# Altium schematic sheet Servo3.SchDoc
size 420 x 297 mm; SheetNumber: 21; SheetTotal: 32
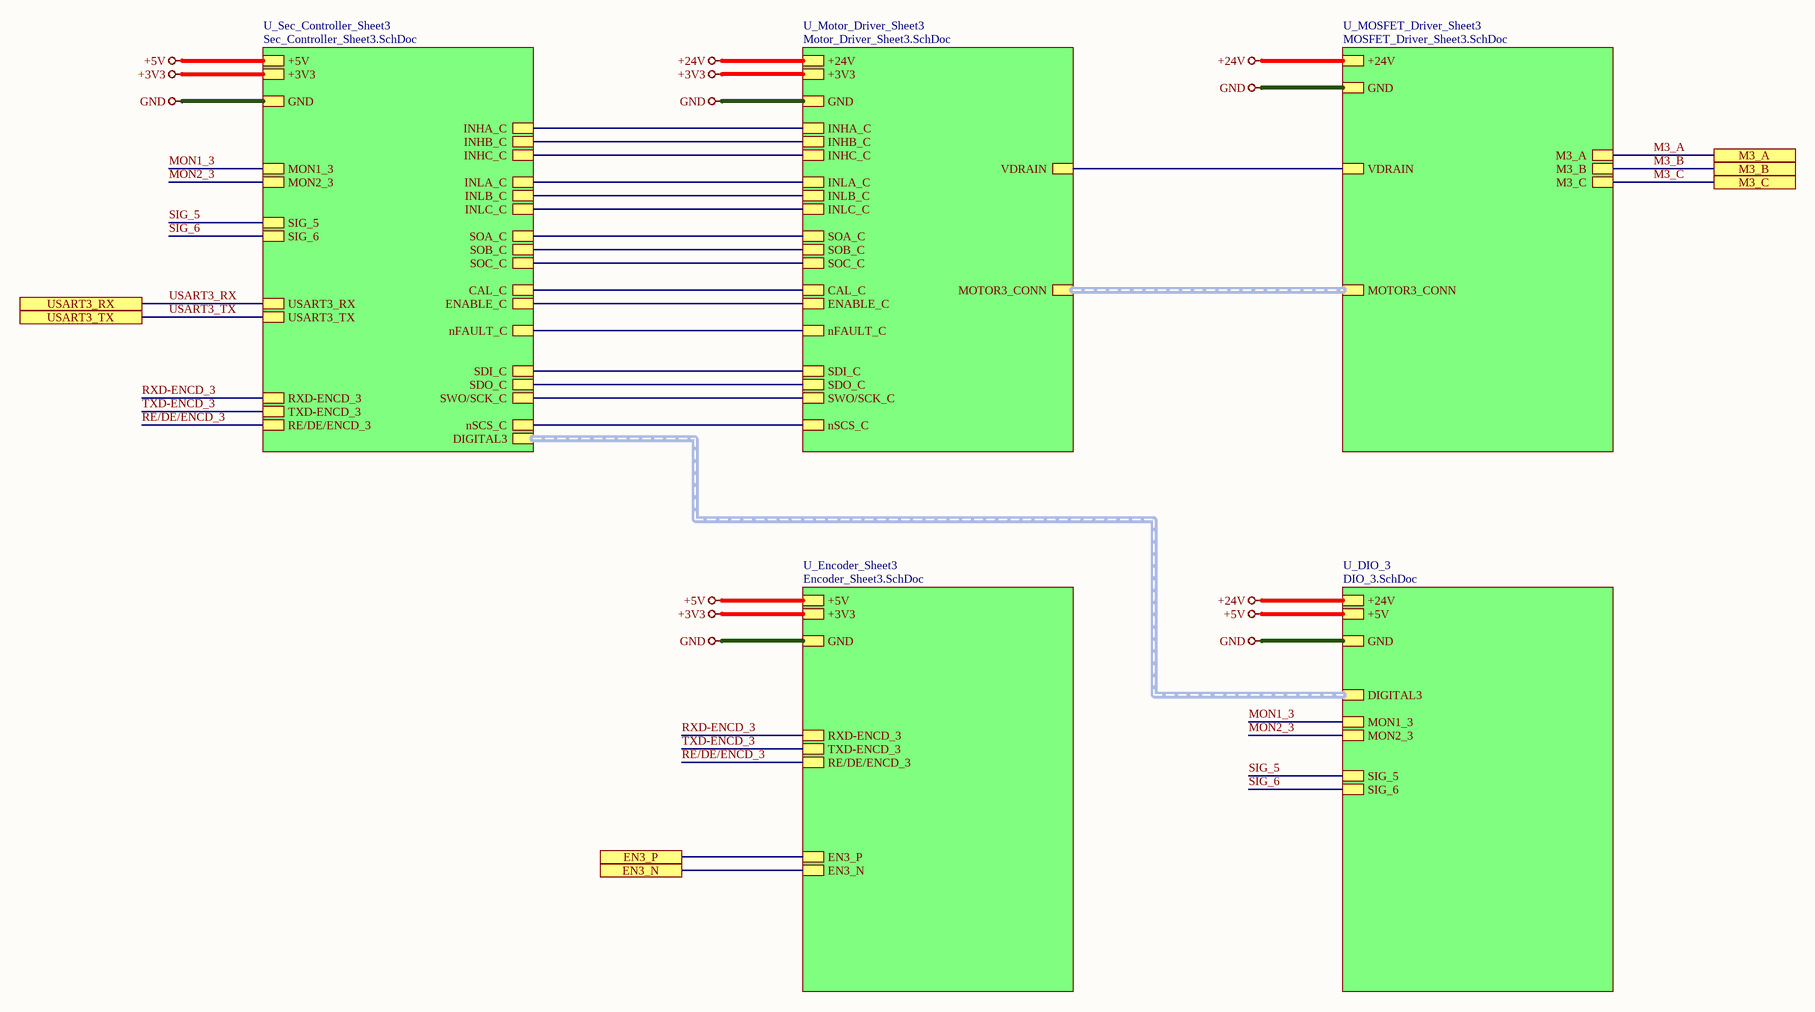
[diagram p0: Servo3.SchDoc]

## Sub-sheets
U_DIO_3 = DIO_3.SchDoc: +24V, +5V, GND, MON1_3, MON2_3, SIG_5, SIG_6, DIGITAL3 (harness DIGITAL1)
U_Encoder_Sheet3 = Encoder_Sheet3.SchDoc: +3V3, +5V, GND, EN3_N, EN3_P, RXD-ENCD_3, TXD-ENCD_3, RE/DE/ENCD_3
U_MOSFET_Driver_Sheet3 = MOSFET_Driver_Sheet3.SchDoc: +24V, GND, MOTOR3_CONN (harness MOTOR3_CONN), M3_A, M3_B, M3_C, VDRAIN
U_Motor_Driver_Sheet3 = Motor_Driver_Sheet3.SchDoc: +24V, +3V3, GND, MOTOR3_CONN (harness MOTOR3_CONN), INHA_C, INHB_C, INHC_C, INLA_C, INLB_C, INLC_C, nSCS_C, SDI_C, SDO_C, SWO/SCK_C, SOC_C, SOB_C, SOA_C, CAL_C, ENABLE_C, VDRAIN, nFAULT_C
U_Sec_Controller_Sheet3 = Sec_Controller_Sheet3.SchDoc: +3V3, GND, INHA_C, INHB_C, INHC_C, INLA_C, INLB_C, INLC_C, nSCS_C, SDI_C, SDO_C, SWO/SCK_C, SOC_C, SOB_C, SOA_C, CAL_C, ENABLE_C, nFAULT_C, USART3_RX, USART3_TX, RXD-ENCD_3, TXD-ENCD_3, RE/DE/ENCD_3, MON1_3, MON2_3, SIG_5, SIG_6, DIGITAL3 (harness DIGITAL1), +5V

## Ports
EN3_N (see Top_Sheet[4B], Connector_Sheet[3D], Encoder_Sheet3[2D]), EN3_P (see Top_Sheet[4B], Connector_Sheet[3D], Encoder_Sheet3[2D]), M3_A (see Top_Sheet[4C], Connector_Sheet[4D], MOSFET_Driver_Sheet3[3D]), M3_B (see Top_Sheet[4C], Connector_Sheet[4D], MOSFET_Driver_Sheet3[3D]), M3_C (see Top_Sheet[4C], Connector_Sheet[4D], MOSFET_Driver_Sheet3[3D]), USART3_RX (see Top_Sheet[4B], Controller_Sheet[2D], Sec_Controller_Sheet3[1D]), USART3_TX (see Top_Sheet[4B], Controller_Sheet[2D], Sec_Controller_Sheet3[1D])

## Nets
+3V3: sheet U_Motor_Driver_Sheet3/+3V3, sheet U_Sec_Controller_Sheet3/+3V3, sheet U_Encoder_Sheet3/+3V3
+5V: sheet U_Sec_Controller_Sheet3/+5V, sheet U_Encoder_Sheet3/+5V, sheet U_DIO_3/+5V
+24V: sheet U_MOSFET_Driver_Sheet3/+24V, sheet U_Motor_Driver_Sheet3/+24V, sheet U_DIO_3/+24V
GND: sheet U_MOSFET_Driver_Sheet3/GND, sheet U_Motor_Driver_Sheet3/GND, sheet U_Sec_Controller_Sheet3/GND, sheet U_Encoder_Sheet3/GND, sheet U_DIO_3/GND
EN3_N: port EN3_N, sheet U_Encoder_Sheet3/EN3_N
EN3_P: port EN3_P, sheet U_Encoder_Sheet3/EN3_P
M3_A: port M3_A, sheet U_MOSFET_Driver_Sheet3/M3_A
M3_B: port M3_B, sheet U_MOSFET_Driver_Sheet3/M3_B
M3_C: port M3_C, sheet U_MOSFET_Driver_Sheet3/M3_C
MON1_3: sheet U_Sec_Controller_Sheet3/MON1_3, sheet U_DIO_3/MON1_3
MON2_3: sheet U_Sec_Controller_Sheet3/MON2_3, sheet U_DIO_3/MON2_3
RE/DE/ENCD_3: sheet U_Sec_Controller_Sheet3/RE/DE/ENCD_3, sheet U_Encoder_Sheet3/RE/DE/ENCD_3
RXD-ENCD_3: sheet U_Sec_Controller_Sheet3/RXD-ENCD_3, sheet U_Encoder_Sheet3/RXD-ENCD_3
SIG_5: sheet U_Sec_Controller_Sheet3/SIG_5, sheet U_DIO_3/SIG_5
SIG_6: sheet U_Sec_Controller_Sheet3/SIG_6, sheet U_DIO_3/SIG_6
TXD-ENCD_3: sheet U_Sec_Controller_Sheet3/TXD-ENCD_3, sheet U_Encoder_Sheet3/TXD-ENCD_3
USART3_RX: port USART3_RX, sheet U_Sec_Controller_Sheet3/USART3_RX
USART3_TX: port USART3_TX, sheet U_Sec_Controller_Sheet3/USART3_TX
(unnamed): sheet U_MOSFET_Driver_Sheet3/VDRAIN, sheet U_Motor_Driver_Sheet3/VDRAIN
(unnamed): sheet U_Motor_Driver_Sheet3/INHA_C, sheet U_Sec_Controller_Sheet3/INHA_C
(unnamed): sheet U_Motor_Driver_Sheet3/INHB_C, sheet U_Sec_Controller_Sheet3/INHB_C
(unnamed): sheet U_Motor_Driver_Sheet3/INHC_C, sheet U_Sec_Controller_Sheet3/INHC_C
(unnamed): sheet U_Motor_Driver_Sheet3/INLA_C, sheet U_Sec_Controller_Sheet3/INLA_C
(unnamed): sheet U_Motor_Driver_Sheet3/INLB_C, sheet U_Sec_Controller_Sheet3/INLB_C
(unnamed): sheet U_Motor_Driver_Sheet3/INLC_C, sheet U_Sec_Controller_Sheet3/INLC_C
(unnamed): sheet U_Motor_Driver_Sheet3/nSCS_C, sheet U_Sec_Controller_Sheet3/nSCS_C
(unnamed): sheet U_Motor_Driver_Sheet3/SDI_C, sheet U_Sec_Controller_Sheet3/SDI_C
(unnamed): sheet U_Motor_Driver_Sheet3/SDO_C, sheet U_Sec_Controller_Sheet3/SDO_C
(unnamed): sheet U_Motor_Driver_Sheet3/SWO/SCK_C, sheet U_Sec_Controller_Sheet3/SWO/SCK_C
(unnamed): sheet U_Motor_Driver_Sheet3/SOC_C, sheet U_Sec_Controller_Sheet3/SOC_C
(unnamed): sheet U_Motor_Driver_Sheet3/SOB_C, sheet U_Sec_Controller_Sheet3/SOB_C
(unnamed): sheet U_Motor_Driver_Sheet3/SOA_C, sheet U_Sec_Controller_Sheet3/SOA_C
(unnamed): sheet U_Motor_Driver_Sheet3/CAL_C, sheet U_Sec_Controller_Sheet3/CAL_C
(unnamed): sheet U_Motor_Driver_Sheet3/ENABLE_C, sheet U_Sec_Controller_Sheet3/ENABLE_C
(unnamed): sheet U_Motor_Driver_Sheet3/nFAULT_C, sheet U_Sec_Controller_Sheet3/nFAULT_C

## Buses and harness runs
harness sheet U_DIO_3/DIGITAL3 = sheet U_Sec_Controller_Sheet3/DIGITAL3
harness sheet U_MOSFET_Driver_Sheet3/MOTOR3_CONN = sheet U_Motor_Driver_Sheet3/MOTOR3_CONN

## Notes on the sheet
- File:
- Title:
- Date:
- Page
- Num:
- Total:
- Drawn By: Huzaifa Ali